# Altium project Counter_PickUp_v2.PrjPcb
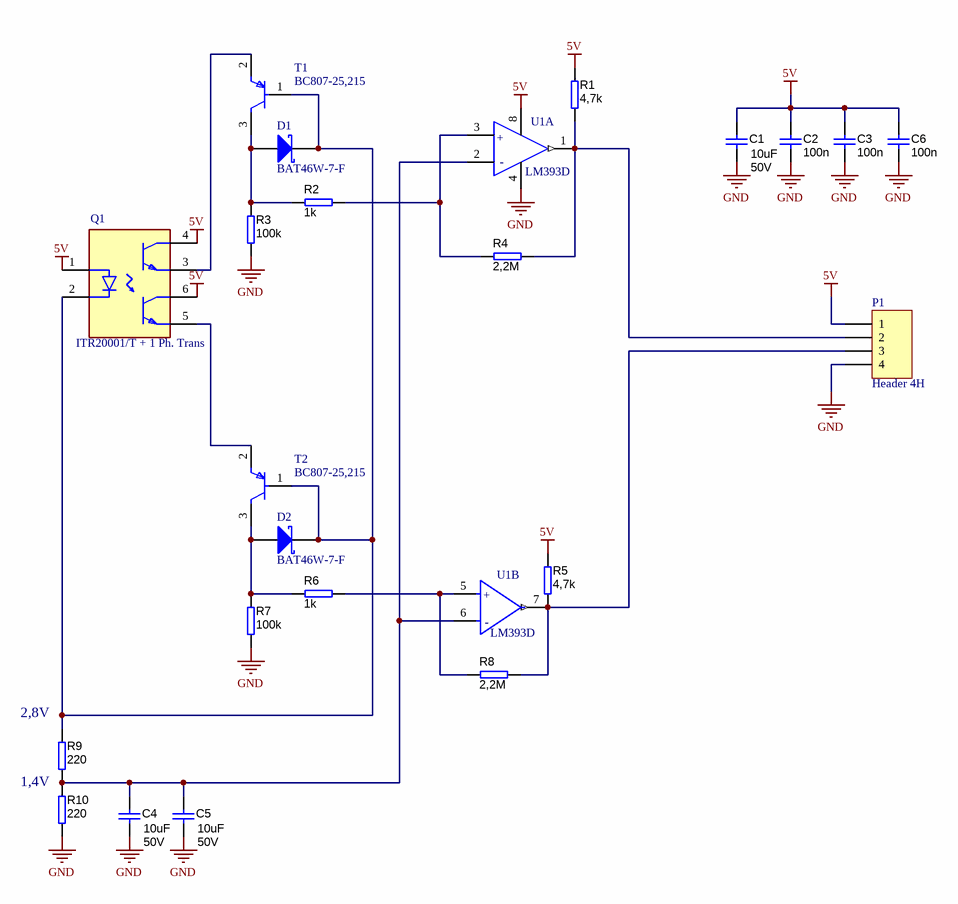
[diagram p0: Counter_PickUp_v2.SchDoc]
author: T.Angelov; Created: 30.10.2023; date: 30.10.2023; revision: 1.0
1 sheet, 23 parts. Net scope: global (net labels, ports and power ports of the same name join across sheets).
Board file: Counter_PickUp_v2.PcbDoc

## Sheet Counter_PickUp_v2.SchDoc
size A4; SPICEModelCacheEMTSWJOG: <root> / <DocumentId>EMTSWJOG</DocumentId> / <CacheFrame Number="0"> / <Model Name="cap" Kind="MDL"> / <Text>*Default semiconductor capacitor / .MODEL CAP C()</Text> / </Model> / </CacheFrame> / </root>; ENG_APP_DATE: --/--/--; DSN_APP_DATE: --/--/--; CHK_APP_DATE: --/--/--; Author: T.Angelov; Organization: MAHLE International GmbH; Address1: Pragstr. 26 - 46; Address2: 70376 Stuttgart; Address3: Germany; Revision: 1.0; SheetNumber: 1; SheetTotal: 1

### Parts
C1  value 10uF  Value1: 50V  [1206_180]
C2  value 100n  [0805_HV]
C3  value 100n  [0805_HV]
C4  value 10uF  Value1: 50V  [1206_180]
C5  value 10uF  Value1: 50V  [1206_180]
C6  value 100n  [0805_HV]
D1  BAT46W-7-F  [SOD-123-2_V]
D2  BAT46W-7-F  [SOD-123-2_V]
P1  Header 4H  [HDR1X4H]
Q1  Photo_T  [Photo_T]  (value not drawn)
R1  value 4,7k  [0805_HV]
R2  value 1k  [0805_HV]
R3  value 100k  [0805_HV]
R4  value 2,2M  [0805_HV]
R5  value 4,7k  [0805_HV]
R6  value 1k  [0805_HV]
R7  value 100k  [0805_HV]
R8  value 2,2M  [0805_HV]
R9  value 220  [0805_HV]
R10  value 220  [0805_HV]
T1  BC807-25,215  [SOT23_0]
T2  BC807-25,215  [SOT23_0]
U1  LM393D  [SO8_IPC_A]  (parts A,B of 2)

### Nets
5V: C1.1 C2.2 C3.2 C6.2 P1.1 Q1.1(1_ANODE) Q1.4(C) Q1.6(C) R1.1 R5.1 U1.8(Vcc+)
GND: C1.2 C2.1 C3.1 C4.2 C5.2 C6.1 P1.4 R3.2 R7.2 R10.1 U1.4(Vcc-)
NetC4_1: C4.1 C5.1 R9.1 R10.2 U1.2(In1-) U1.6(In2-)
NetD1_1: D1.1(A) R2.1 R3.1 T1.3(C)
NetD1_2: D1.2(K) D2.2(K) Q1.2(1_CATHODE) R9.2 T1.1(B) T2.1(B)
NetD2_1: D2.1(A) R6.1 R7.1 T2.3(C)
NetP1_2: P1.2 R1.2 R4.1 U1.1(Out1)
NetP1_3: P1.3 R5.2 R8.1 U1.7(Out2)
NetQ1_3: Q1.3(E) T1.2(E)
NetQ1_5: Q1.5(E) T2.2(E)
NetR2_2: R2.2 R4.2 U1.3(In1+)
NetR6_2: R6.2 R8.2 U1.5(In2+)

### Notes on the sheet
- (near Q1) ITR20001/T + 1 Ph. Trans
- (near R9) 2,8V
- 1,4V
- File:
- Created:
- Checked
- Released:
- Date
- Name
- Size:
- Sheet
- Revision:
- A4
- of
- HSI_No.
- (in symbol LM393D, part A) +; -
- (in symbol LM393D, part B) +; -

### Library data of the parts
C1 C4 C5 = C1206: CAP, CERM, NP0, 1206; Tolerance_%: 10; TempCo: X7R; TaMin_C: -55; TaMax_C: 125; SizeArea_mm2: 5.12; SizeAreaWB_mm2: 10.92; SizeX_mm: 3.2; SizeY_mm: 1.6; SizeZ_mm: 1.8; PackageReference: 1206; MountType: SMT; Technology: Ceramic
C2 C3 C6 = C0805: CAP, CERM, +/- 10%, X7S,  0805; CompType: Capacitor; Tolerance_%: 10; SizeArea_mm2: 2.5; SizeAreaWB_mm2: 6.75; SizeX_mm: 2; SizeY_mm: 1.25; SizeZ_mm: 1.45; Value1: 25V; PackageReference: 0805; MountType: SMT; Technology: Ceramic; TempCo: X7S
D1 D2 = BAT46W-7-F: Surface Mount Schottky Barrier Diode, 100 V, -55 to 125 degC, 2-Pin SOD123, RoHS, Tape and Reel; Manufacturer: Diodes Inc; CT@1 V: 12 pF Typ.; V(BR)R: 100 V Min.; IR@1.5 V: 0.3 uA Max.; VF@10 mA: 0.45 V Max.; ComponentLink1Description: Manufacturer URL; ComponentLink3Description: Package Specification; ComponentLink3URL: http://diodes.com/datasheets/ds30044.pdf; DatasheetVersion: Rev. 16-2; ComponentLink1URL: http://www.diodes.com/; Operating Temperature: -55 to 125 degC; Mounting Technology: Surface Mount; Packing: Tape and Reel; ComponentLink2Description: Datasheet; PartNumber: BAT46W-7-F; PackageDescription: 2-Pin SMD, Body 2.7 x 1.55 mm, Height 1.45 mm; ComponentLink2URL: http://diodes.com/datasheets/ds30044.pdf; RoHS: TRUE
P1 = Header 4H: Header, 4-Pin, Right Angle; LatestRevisionDate: 17-Jul-2002; LatestRevisionNote: Re-released for DXP Platform.; Publisher: Altium Limited
R1-R10 = R0805: RES, 1%, 0.1 W, 0805; SizeX_mm: 2; SizeY_mm: 1.25; SizeZ_mm: 0.75; PackageReference: 0805; Value1: 1%; MountType: SMT